# EAGLE schematic new_sawtag_2012 (EAGLE 6.5.0)

## Sheet 1 of 4
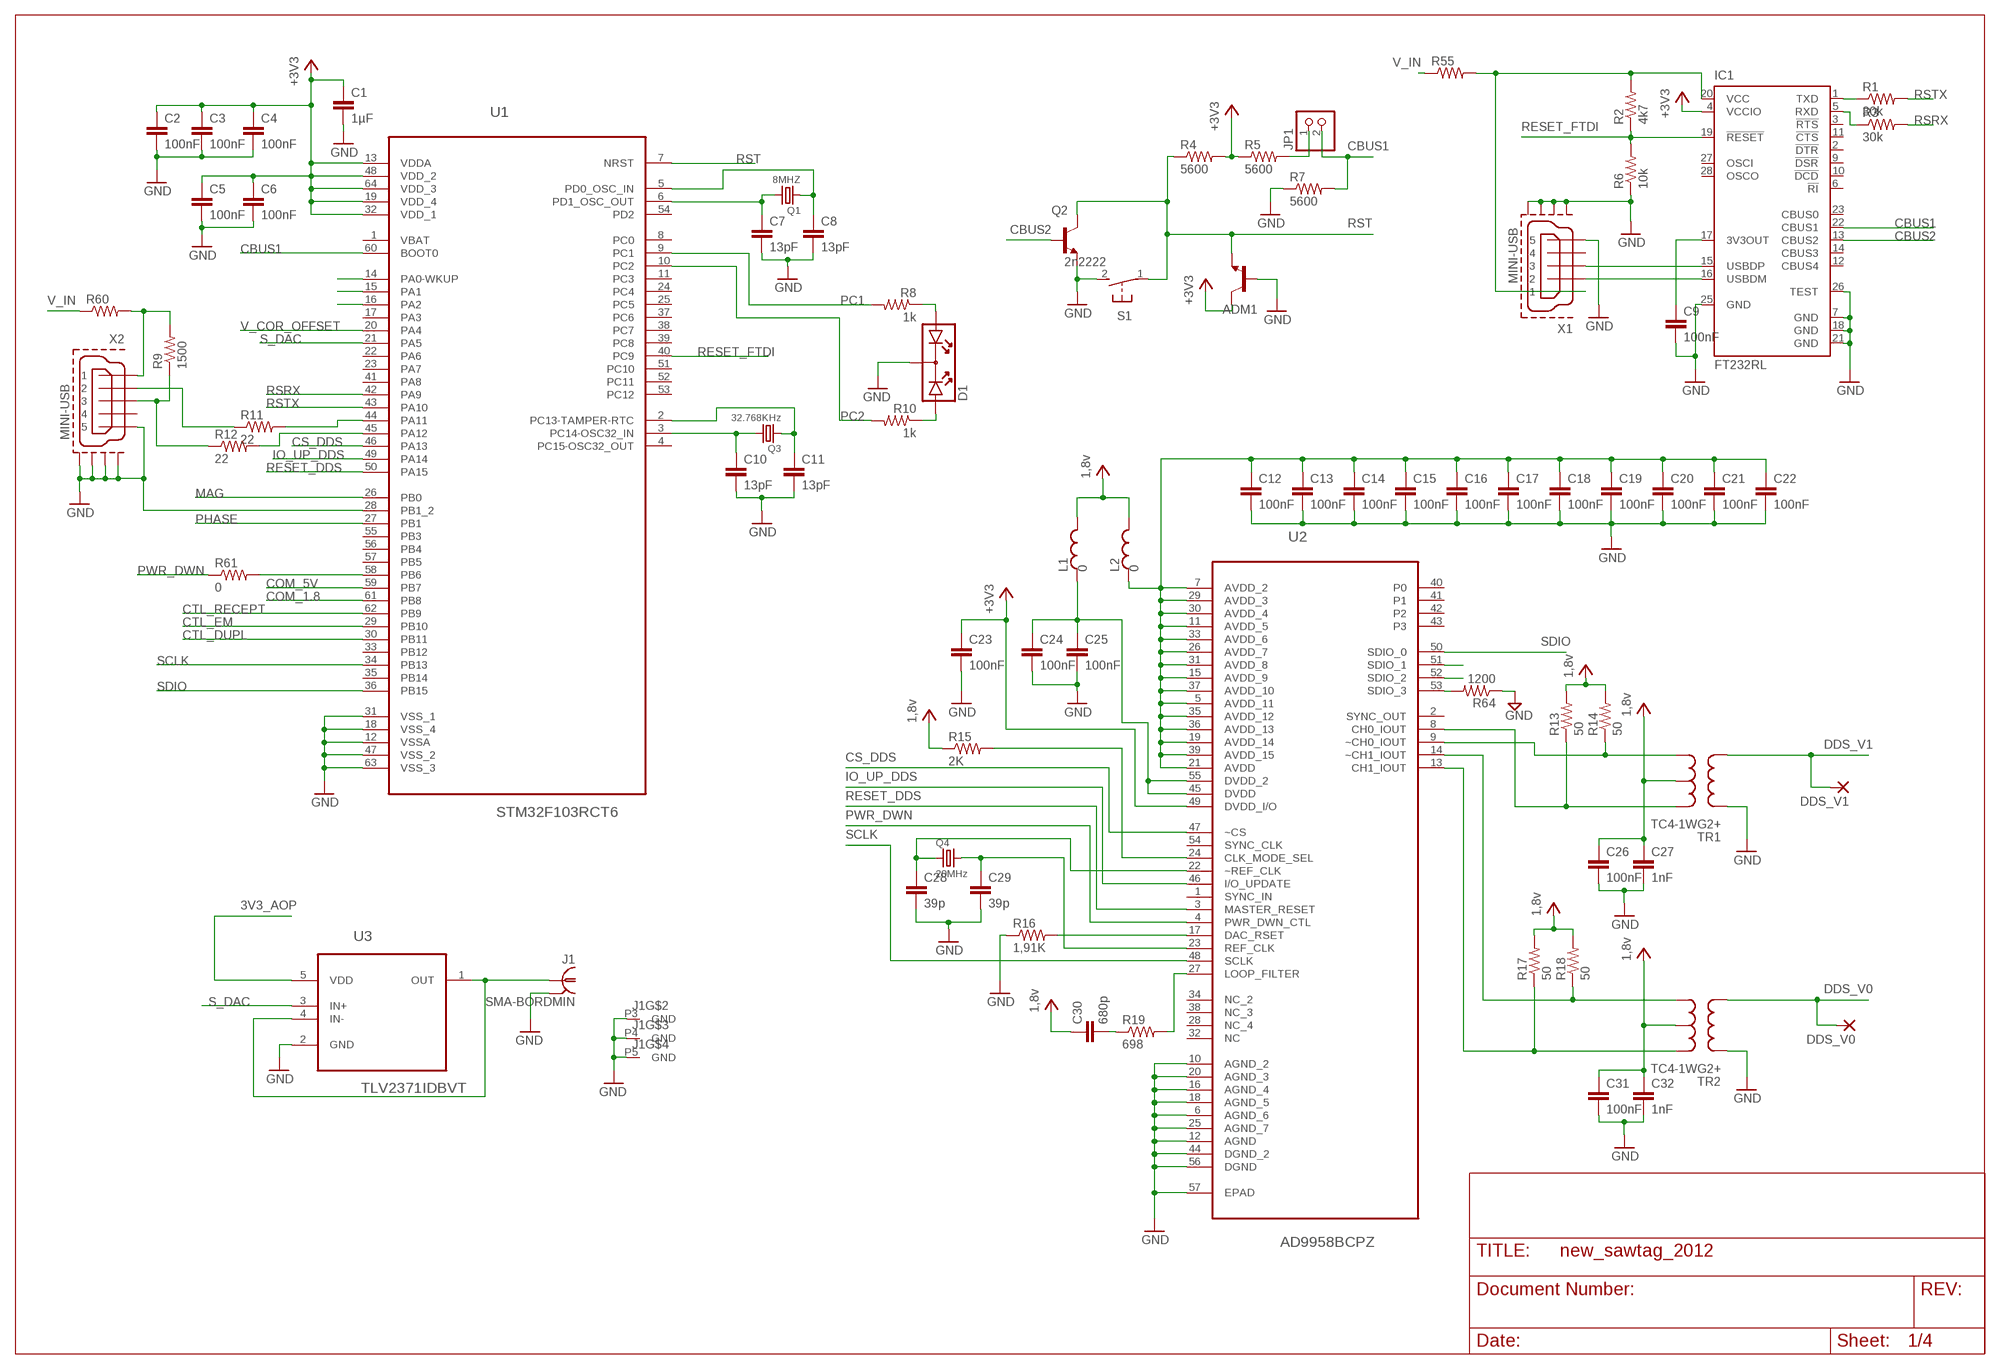
[diagram p0: schematic, sheet 1]

### Parts
ADM1  TRANSISTOR_NPNSOT23  [SOT23]
C1  1µF  C-EUC0805  [C0805]
C2  100nF  C-EUC0603  [C0603]
C3  100nF  C-EUC0603  [C0603]
C4  100nF  C-EUC0603  [C0603]
C5  100nF  C-EUC0603  [C0603]
C6  100nF  C-EUC0603  [C0603]
C7  13pF  C-EUC0603  [C0603]
C8  13pF  C-EUC0603  [C0603]
C9  100nF  C-EUC0603  [C0603]
C10  13pF  C-EUC0603  [C0603]
C11  13pF  C-EUC0603  [C0603]
C12  100nF  C-EUC0402  [C0402]
C13  100nF  C-EUC0402  [C0402]
C14  100nF  C-EUC0402  [C0402]
C15  100nF  C-EUC0402  [C0402]
C16  100nF  C-EUC0402  [C0402]
C17  100nF  C-EUC0402  [C0402]
C18  100nF  C-EUC0402  [C0402]
C19  100nF  C-EUC0402  [C0402]
C20  100nF  C-EUC0402  [C0402]
C21  100nF  C-EUC0402  [C0402]
C22  100nF  C-EUC0402  [C0402]
C23  100nF  C-EUC0603  [C0603]
C24  100nF  C-EUC0603  [C0603]
C25  100nF  C-EUC0603  [C0603]
C26  100nF  C-EUC0603  [C0603]
C27  1nF  C-EUC0402  [C0402]
C28  39p  C-EUC0402  [C0402]
C29  39p  C-EUC0402  [C0402]
C30  680p  C-EUC0402  [C0402]
C31  100nF  C-EUC0603  [C0603]
C32  1nF  C-EUC0402  [C0402]
D1  DUOLED  [DUOLED]
DDS_V0  1,6/0,8  [1,6/0,8]
DDS_V1  1,6/0,8  [1,6/0,8]
IC1  FT232RL  [SSOP28]
J1  SMA-BORDMIN  [SMA_BORDMIN]
JP1  PINHD-1X2  [1X02]
L1  0  L_0603  [0603]
L2  0  L_0603  [0603]
Q1  8MHZ  Q_20MHZ_SMD  [SMD_5*3]
Q2  2n2222  TRANSISTOR_NPNSOT23  [SOT23]
Q3  32.768KHz  Q_32K_SMD  [SMD_32K]
Q4  20MHz  Q_20MHZ_SMD  [SMD_5*3]
R1  30k  R-US_R0402  [R0402]
R2  4k7  R-US_R0402  [R0402]
R3  30k  R-US_R0402  [R0402]
R4  5600  R-US_R0603  [R0603]
R5  5600  R-US_R0603  [R0603]
R6  10k  R-US_R0402  [R0402]
R7  5600  R-US_R0603  [R0603]
R8  1k  R-US_R0603  [R0603]
R9  1500  R-US_R1206  [R1206]
R10  1k  R-US_R0603  [R0603]
R11  22  R-US_R0603  [R0603]
R12  22  R-US_R0603  [R0603]
R13  50  R-US_R0402  [R0402]
R14  50  R-US_R0402  [R0402]
R15  2K  R-US_R0402  [R0402]
R16  1,91K  R-US_R0402  [R0402]
R17  50  R-US_R0402  [R0402]
R18  50  R-US_R0402  [R0402]
R19  698  R-US_R0402  [R0402]
R55  R-US_R2512  [R2512]
R60  R-US_R2512  [R2512]
R61  0  R-US_R0603  [R0603]
R64  1200  R-US_R0402  [R0402]
S1  31-XX  [B3F-31XX]
TR1  TC4-1WG2+  [AT224-3]
TR2  TC4-1WG2+  [AT224-3]
U1  STM32F103RCT6  [QFP50P1200X1200X160-64N]
U2  AD9958BCPZ  [QFN50P800X800X100-57N]
U3  TLV2371IDBVT  [SOT95P280X145-5N]
X1  MINI-USB  MINI-USB-SHIELD-UX60-MB-5ST  [UX60-MB-5ST]
X2  MINI-USB  MINI-USB-SHIELD-UX60-MB-5ST  [UX60-MB-5ST]

### Nets
3V3_AOP: U3.5(VDD) ; also sheet 2,4
+3V3: ADM1.3(C) C1.1 C2.1 C3.1 C4.1 C5.1 C6.1 C23.1 IC1.4(VCCIO) R4.2 R5.1 U1.13(VDDA) U1.19(VDD_4) U1.32(VDD_1) U1.48(VDD_2) U1.64(VDD_3) U2.49(DVDD_I/O) ; also sheet 4
ALDDS: C12.1 C13.1 C14.1 C15.1 C16.1 C17.1 C18.1 C19.1 C20.1 C21.1 C22.1 L2.1 U2.5(AVDD_11) U2.7(AVDD_2) U2.11(AVDD_5) U2.15(AVDD_9) U2.19(AVDD_14) U2.21(AVDD) U2.26(AVDD_7) U2.29(AVDD_3) U2.30(AVDD_4) U2.31(AVDD_8) U2.33(AVDD_6) U2.35(AVDD_12) U2.36(AVDD_13) U2.37(AVDD_10) U2.39(AVDD_15)
CBUS1: IC1.22(CBUS1) JP1.2 R7.2 U1.60(BOOT0)
CBUS2: IC1.13(CBUS2) Q2.1(B)
COM_1.8: U1.61(PB8) ; also sheet 4
COM_5V: U1.59(PB7) ; also sheet 4
CS_DDS: U1.46(PA13) U2.47(~CS)
CTL_DUPL: U1.30(PB11) ; also sheet 3
CTL_EM: U1.29(PB10) ; also sheet 3
CTL_RECEPT: U1.62(PB9) ; also sheet 3
DDS_V0: DDS_V0.1(P) TR2.P6(P2) ; also sheet 3
DDS_V1: DDS_V1.1(P) TR1.P6(P2) ; also sheet 3
GND: ADM1.1(B) C1.2 C2.2 C3.2 C4.2 C5.2 C6.2 C7.2 C8.2 C9.2 C10.2 C11.2 C12.2 C13.2 C14.2 C15.2 C16.2 C17.2 C18.2 C19.2 C20.2 C21.2 C22.2 C23.2 C24.2 C25.2 C26.2 C27.2 C28.2 C29.2 C31.2 C32.2 D1.K IC1.7(GND) IC1.18(GND) IC1.21(GND) IC1.25(GND) IC1.26(TEST) J1.P1(GND) J1.P3(GND) J1.P4(GND) J1.P5(GND) Q2.2(E) R6.1 R7.1 R16.1 R64.1 S1.2(S) TR1.P4(P1) TR2.P4(P1) U1.12(VSSA) U1.18(VSS_4) U1.28(PB1_2) U1.31(VSS_1) U1.47(VSS_2) U1.63(VSS_3) U2.6(AGND_6) U2.10(AGND_2) U2.12(AGND) U2.16(AGND_4) U2.18(AGND_5) U2.20(AGND_3) U2.25(AGND_7) U2.44(DGND_2) U2.56(DGND) U2.57(EPAD) U3.2(GND) X1.5 X1.M1(GND1) X1.M2(GND2) X1.M3(GND3) X1.M4(GND4) X2.5 X2.M1(GND1) X2.M2(GND2) X2.M3(GND3) X2.M4(GND4) ; also sheet 2,3,4
IO_UP_DDS: U1.49(PA14) U2.46(I/O_UPDATE)
MAG: U1.26(PB0) ; also sheet 2
N$1: R16.2 U2.17(DAC_RSET)
N$2: R19.2 U2.27(LOOP_FILTER)
N$3: C30.2 R19.1
N$4: C28.1 Q4.P$1 U2.22(~REF_CLK)
N$5: C29.1 Q4.P$3 U2.23(REF_CLK)
N$6: R15.2 U2.24(CLK_MODE_SEL)
N$7: R17.1 TR2.P3(S1) U2.13(CH1_IOUT)
N$8: R18.1 TR2.P1(S3) U2.14(~CH1_IOUT)
N$9: R14.1 TR1.P1(S3) U2.9(~CH0_IOUT)
N$83: R13.1 TR1.P3(S1) U2.8(CH0_IOUT)
N$96: C24.1 C25.1 L1.1 U2.45(DVDD) U2.55(DVDD_2)
N$97: R9.2 R60.2 X2.1
N$98: J1.P2 U3.1(OUT) U3.4(IN-)
N$105: R61.2 U1.58(PB6)
N$106: R11.2 U1.44(PA11)
N$107: IC1.16(USBDM) X1.2
N$112: IC1.20(VCC) R2.2 R55.2 X1.1
N$119: R12.2 U1.45(PA12)
N$120: IC1.15(USBDP) X1.3
N$122: C9.1 IC1.17(3V3OUT)
N$123: IC1.1(TXD) R1.1
N$124: IC1.5(RXD) R3.1
N$127: C8.1 Q1.P$1 U1.5(PD0_OSC_IN)
N$128: JP1.1 R5.2
N$129: C7.1 Q1.P$3 U1.6(PD1_OSC_OUT)
N$135: R11.1 X2.2
N$139: D1.A2 R8.1
N$140: C10.1 Q3.P$2 U1.3(PC14-OSC32_IN)
N$141: C11.1 Q3.P$1 U1.2(PC13-TAMPER-RTC)
N$142: D1.A1 R10.1
N$143: R9.1 R12.1 X2.3
PC1: R8.2 U1.9(PC1)
PC2: R10.2 U1.10(PC2)
PHASE: U1.27(PB1) ; also sheet 2
PWR_DWN: R61.1 U2.4(PWR_DWN_CTL)
RESET_DDS: U1.50(PA15) U2.3(MASTER_RESET)
RESET_FTDI: IC1.19(!RESET) R2.1 R6.2 U1.40(PC9)
RSRX: R3.2 U1.42(PA9)
RST: ADM1.2(E) Q2.3(C) R4.1 S1.1(P) U1.7(NRST)
RSTX: R1.2 U1.43(PA10)
S_DAC: U1.21(PA5) U3.3(IN+)
SCLK: U1.34(PB13) U2.48(SCLK)
SDIO: U1.36(PB15) U2.50(SDIO_0)
SDIO_1: U1.14(PA0-WKUP) U2.51(SDIO_1)
SDIO_2: U1.15(PA1) U2.52(SDIO_2)
SDIO_3: R64.2 U1.16(PA2) U2.53(SDIO_3)
V_COR_OFFSET: U1.20(PA4) ; also sheet 2
V_IN: R55.1 R60.1 ; also sheet 4
VCC: C26.1 C27.1 C30.1 C31.1 C32.1 L1.2 L2.2 R13.2 R14.2 R15.1 R17.2 R18.2 TR1.P2(S2) TR2.P2(S2) ; supply symbol labelled 1,8v ; also sheet 4
Unconnected: IC1.2(!DTR) IC1.3(!RTS) IC1.6(!RI) IC1.9(!DSR) IC1.10(!DCD) IC1.11(!CTS) IC1.12(CBUS4) IC1.14(CBUS3) IC1.23(CBUS0) IC1.27(OSCI) IC1.28(OSCO) U1.1(VBAT) U1.4(PC15-OSC32_OUT) U1.8(PC0) U1.11(PC3) U1.17(PA3) U1.22(PA6) U1.24(PC4) U1.25(PC5) U1.33(PB12) U1.35(PB14) U1.37(PC6) U1.38(PC7) U1.39(PC8) U1.41(PA8) U1.51(PC10) U1.52(PC11) U1.53(PC12) U1.54(PD2) U1.55(PB3) U1.56(PB4) U1.57(PB5) U2.1(SYNC_IN) U2.2(SYNC_OUT) U2.28(NC_4) U2.32(NC) U2.34(NC_2) U2.38(NC_3) U2.40(P0) U2.41(P1) U2.42(P2) U2.43(P3) U2.54(SYNC_CLK) X1.4 X2.4

## Sheet 2 of 4
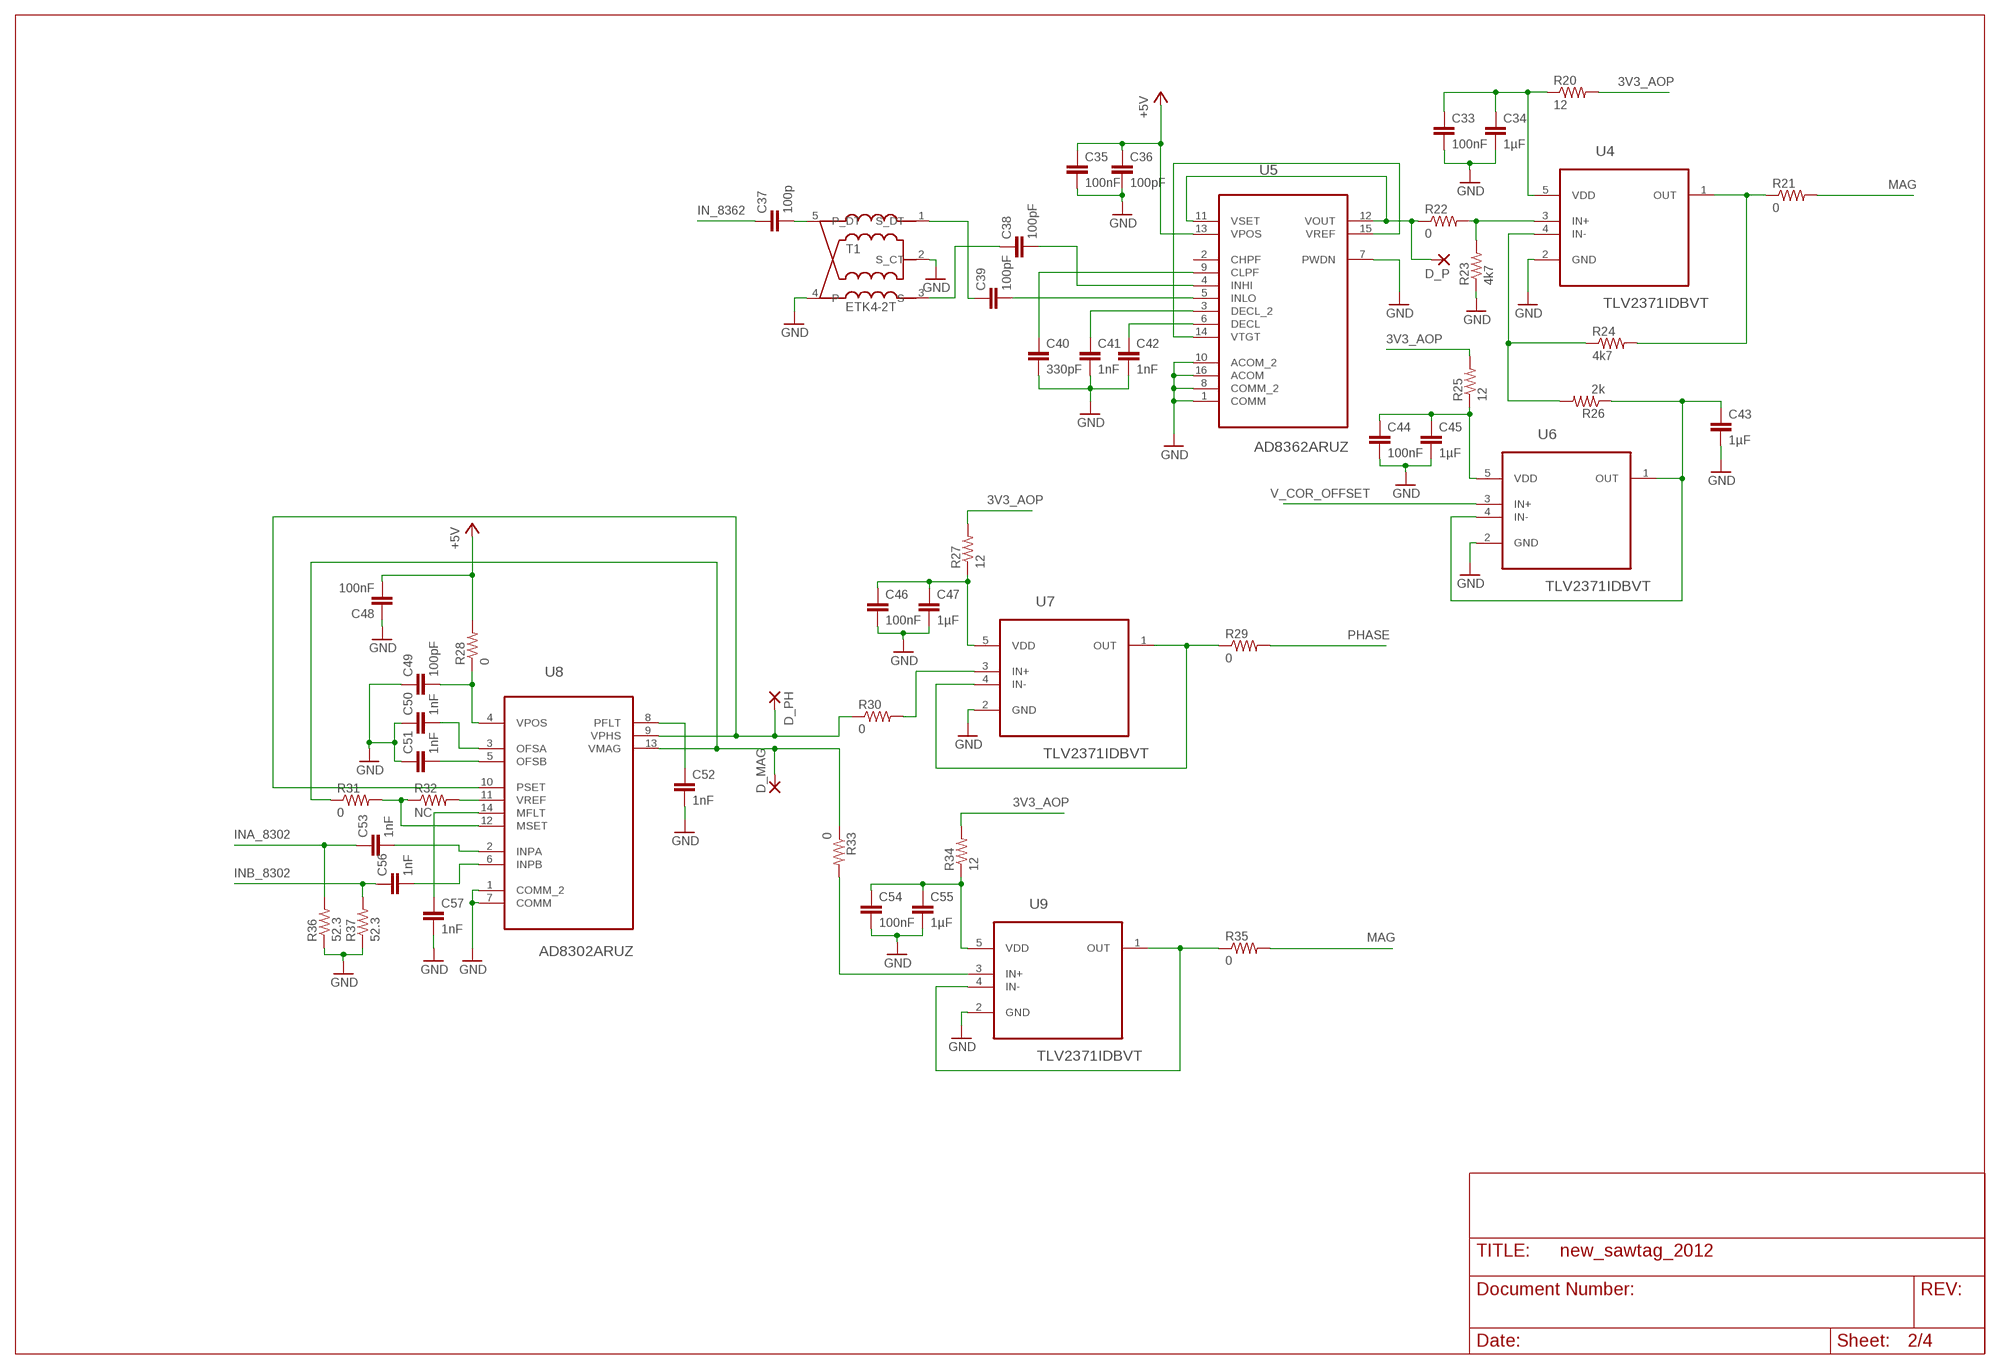
[diagram p1: schematic, sheet 2]

### Parts
C33  100nF  C-EUC0402  [C0402]
C34  1µF  C-EUC0603  [C0603]
C35  100nF  C-EUC0603  [C0603]
C36  100pF  C-EUC0603  [C0603]
C37  100p  C-EUC0402  [C0402]
C38  100pF  C-EUC0402  [C0402]
C39  100pF  C-EUC0402  [C0402]
C40  330pF  C-EUC0603  [C0603]
C41  1nF  C-EUC0603  [C0603]
C42  1nF  C-EUC0603  [C0603]
C43  1µF  C-EUC0603  [C0603]
C44  100nF  C-EUC0402  [C0402]
C45  1µF  C-EUC0603  [C0603]
C46  100nF  C-EUC0402  [C0402]
C47  1µF  C-EUC0603  [C0603]
C48  100nF  C-EUC0603  [C0603]
C49  100pF  C-EUC0402  [C0402]
C50  1nF  C-EUC0402  [C0402]
C51  1nF  C-EUC0402  [C0402]
C52  1nF  C-EUC0402  [C0402]
C53  1nF  C-EUC0402  [C0402]
C54  100nF  C-EUC0402  [C0402]
C55  1µF  C-EUC0603  [C0603]
C56  1nF  C-EUC0402  [C0402]
C57  1nF  C-EUC0402  [C0402]
D_MAG  1,6/0,8  [1,6/0,8]
D_P  1,6/0,8  [1,6/0,8]
D_PH  1,6/0,8  [1,6/0,8]
R20  12  R-US_R0603  [R0603]
R21  0  R-US_R0603  [R0603]
R22  0  R-US_R0603  [R0603]
R23  4k7  R-US_R0603  [R0603]
R24  4k7  R-US_R0603  [R0603]
R25  12  R-US_R0603  [R0603]
R26  2k  R-US_R0603  [R0603]
R27  12  R-US_R0603  [R0603]
R28  0  R-US_R0603  [R0603]
R29  0  R-US_R0603  [R0603]
R30  0  R-US_R0603  [R0603]
R31  0  R-US_R0603  [R0603]
R32  NC  R-US_R0603  [R0603]
R33  0  R-US_R0603  [R0603]
R34  12  R-US_R0603  [R0603]
R35  0  R-US_R0603  [R0603]
R36  52.3  R-US_R0603  [R0603]
R37  52.3  R-US_R0603  [R0603]
T1  ETK4-2T  [SM-22]
U4  TLV2371IDBVT  [SOT95P280X145-5N]
U5  AD8362ARUZ  [SOP65P640X120-16N]
U6  TLV2371IDBVT  [SOT95P280X145-5N]
U7  TLV2371IDBVT  [SOT95P280X145-5N]
U8  AD8302ARUZ  [SOP65P640X120-14N]
U9  TLV2371IDBVT  [SOT95P280X145-5N]

### Nets
3V3_AOP: R20.2 R25.2 R27.2 R34.2 ; also sheet 1,4
+5V: C35.1 C36.1 C48.2 R28.2 U5.13(VPOS) ; also sheet 3,4
GND: C33.2 C34.2 C35.2 C36.2 C40.2 C41.2 C42.2 C43.2 C44.2 C45.2 C46.2 C47.2 C48.1 C49.1 C50.1 C51.1 C52.2 C54.2 C55.2 C57.2 R23.1 R36.1 R37.1 T1.2(S_CT) T1.4(P) U4.2(GND) U5.1(COMM) U5.7(PWDN) U5.8(COMM_2) U5.10(ACOM_2) U5.16(ACOM) U6.2(GND) U7.2(GND) U8.1(COMM_2) U8.7(COMM) U9.2(GND) ; also sheet 1,3,4
IN_8362: C37.1 ; also sheet 3
INA_8302: C53.1 R36.2 ; also sheet 3
INB_8302: C56.1 R37.2 ; also sheet 3
MAG: R21.2 R35.2 ; also sheet 1
N$10: D_P.1(P) R22.1 U5.11(VSET) U5.12(VOUT)
N$11: R22.2 R23.2 U4.3(IN+)
N$13: C42.1 U5.6(DECL)
N$14: C41.1 U5.3(DECL_2)
N$15: C40.1 U5.9(CLPF)
N$16: C39.2 U5.5(INLO)
N$17: C38.2 U5.4(INHI)
N$18: R24.1 R26.2 U4.4(IN-)
N$19: U5.14(VTGT) U5.15(VREF)
N$20: C43.1 R26.1 U6.1(OUT) U6.4(IN-)
N$21: C33.1 C34.1 R20.1 U4.5(VDD)
N$22: C50.2 U8.3(OFSA)
N$23: C51.2 U8.5(OFSB)
N$24: C53.2 U8.2(INPA)
N$25: C56.2 U8.6(INPB)
N$26: C44.1 C45.1 R25.1 U6.5(VDD)
N$29: C49.2 R28.1 U8.4(VPOS)
N$31: R30.2 U7.3(IN+)
N$32: R29.1 U7.1(OUT) U7.4(IN-)
N$33: R33.2 U9.3(IN+)
N$34: R35.1 U9.1(OUT) U9.4(IN-)
N$35: C46.1 C47.1 R27.1 U7.5(VDD)
N$36: C54.1 C55.1 R34.1 U9.5(VDD)
N$37: D_MAG.1(P) R31.1 R33.1 U8.13(VMAG)
N$38: D_PH.1(P) R30.1 U8.9(VPHS) U8.10(PSET)
N$81: C39.1 T1.1(S_DT)
N$82: C38.1 T1.3(S)
N$84: C57.1 U8.14(MFLT)
N$85: C52.1 U8.8(PFLT)
N$87: C37.2 T1.5(P_DT)
N$95: R21.1 R24.2 U4.1(OUT)
N$100: R31.2 R32.1 U8.12(MSET)
N$102: R32.2 U8.11(VREF)
PHASE: R29.2 ; also sheet 1
V_COR_OFFSET: U6.3(IN+) ; also sheet 1
Unconnected: U5.2(CHPF)

## Sheet 3 of 4
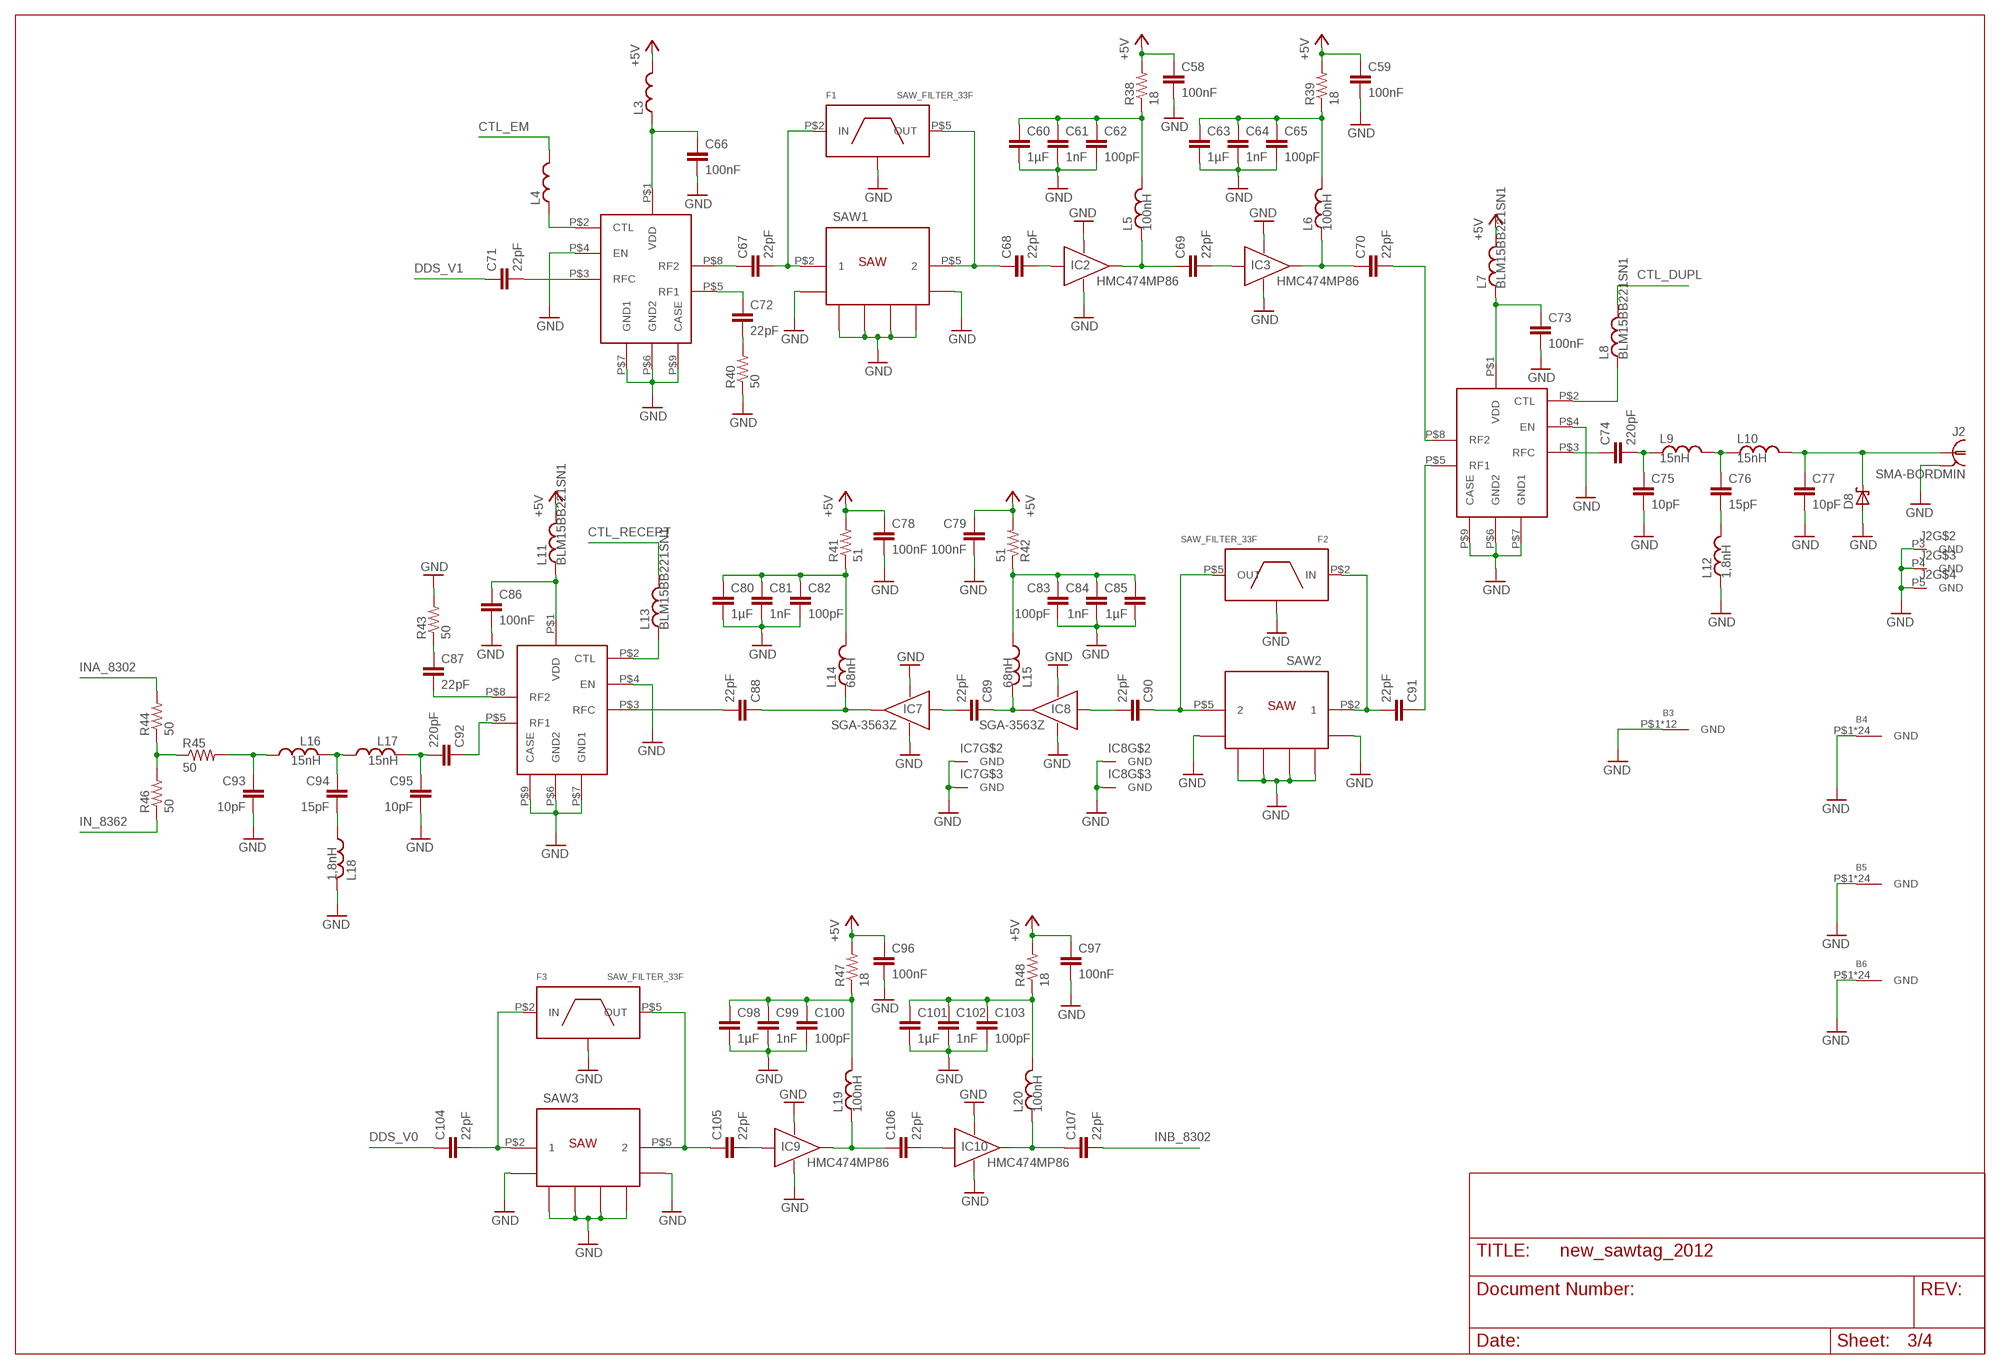
[diagram p2: schematic, sheet 3]

### Parts
B3  BMIS-102  [BMIS-102]
B4  BMIS-205  [BMIS-205]
B5  BMIS-205  [BMIS-205]
B6  BMIS-205  [BMIS-205]
C58  100nF  C-EUC0603  [C0603]
C59  100nF  C-EUC0603  [C0603]
C60  1µF  C-EUC0603  [C0603]
C61  1nF  C-EUC0402  [C0402]
C62  100pF  C-EUC0402  [C0402]
C63  1µF  C-EUC0603  [C0603]
C64  1nF  C-EUC0402  [C0402]
C65  100pF  C-EUC0402  [C0402]
C66  100nF  C-EUC0603  [C0603]
C67  22pF  C-EUC0402  [C0402]
C68  22pF  C-EUC0402  [C0402]
C69  22pF  C-EUC0402  [C0402]
C70  22pF  C-EUC0402  [C0402]
C71  22pF  C-EUC0402  [C0402]
C72  22pF  C-EUC0402  [C0402]
C73  100nF  C-EUC0402  [C0402]
C74  220pF  C-EUC0402  [C0402]
C75  10pF  C-EUC0402  [C0402]
C76  15pF  C-EUC0402  [C0402]
C77  10pF  C-EUC0402  [C0402]
C78  100nF  C-EUC0603  [C0603]
C79  100nF  C-EUC0603  [C0603]
C80  1µF  C-EUC0603  [C0603]
C81  1nF  C-EUC0402  [C0402]
C82  100pF  C-EUC0402  [C0402]
C83  100pF  C-EUC0402  [C0402]
C84  1nF  C-EUC0402  [C0402]
C85  1µF  C-EUC0603  [C0603]
C86  100nF  C-EUC0603  [C0603]
C87  22pF  C-EUC0402  [C0402]
C88  22pF  C-EUC0402  [C0402]
C89  22pF  C-EUC0402  [C0402]
C90  22pF  C-EUC0402  [C0402]
C91  22pF  C-EUC0402  [C0402]
C92  220pF  C-EUC0402  [C0402]
C93  10pF  C-EUC0402  [C0402]
C94  15pF  C-EUC0402  [C0402]
C95  10pF  C-EUC0402  [C0402]
C96  100nF  C-EUC0603  [C0603]
C97  100nF  C-EUC0603  [C0603]
C98  1µF  C-EUC0603  [C0603]
C99  1nF  C-EUC0402  [C0402]
C100  100pF  C-EUC0402  [C0402]
C101  1µF  C-EUC0603  [C0603]
C102  1nF  C-EUC0402  [C0402]
C103  100pF  C-EUC0402  [C0402]
C104  22pF  C-EUC0402  [C0402]
C105  22pF  C-EUC0402  [C0402]
C106  22pF  C-EUC0402  [C0402]
C107  22pF  C-EUC0402  [C0402]
D8  SMF5.0AT1  [SOD123FL]
F1  SAW_FILTER_33F  [BOITIER_3-3]
F2  SAW_FILTER_33F  [BOITIER_3-3]
F3  SAW_FILTER_33F  [BOITIER_3-3]
IC2  HMC474MP86  [VV105]
IC3  HMC474MP86  [VV105]
IC4  HMC349MS8G  [SMT-MS8G]
IC5  HMC349MS8G  [SMT-MS8G]
IC6  HMC349MS8G  [SMT-MS8G]
IC7  SGA-3563Z  [SOT363]
IC8  SGA-3563Z  [SOT363]
IC9  HMC474MP86  [VV105]
IC10  HMC474MP86  [VV105]
J2  SMA-BORDMIN  [SMA_BORDMIN]
L3  L_0402  [0402]
L4  L_0402  [0402]
L5  100nH  L_0603  [0603]
L6  100nH  L_0603  [0603]
L7  BLM15BB221SN1  L_0402  [0402]
L8  BLM15BB221SN1  L_0402  [0402]
L9  15nH  L_0603  [0603]
L10  15nH  L_0603  [0603]
L11  BLM15BB221SN1  L_0402  [0402]
L12  1,8nH  L_0603  [0603]
L13  BLM15BB221SN1  L_0402  [0402]
L14  68nH  L_0603  [0603]
L15  68nH  L_0603  [0603]
L16  15nH  L_0603  [0603]
L17  15nH  L_0603  [0603]
L18  1,8nH  L_0603  [0603]
L19  100nH  L_0603  [0603]
L20  100nH  L_0603  [0603]
R38  18  R-US_R0603  [R0603]
R39  18  R-US_R0603  [R0603]
R40  50  R-US_R0603  [R0603]
R41  51  R-US_R0603  [R0603]
R42  51  R-US_R0603  [R0603]
R43  50  R-US_R0402  [R0402]
R44  50  R-US_R0402  [R0402]
R45  50  R-US_R0402  [R0402]
R46  50  R-US_R0402  [R0402]
R47  18  R-US_R0603  [R0603]
R48  18  R-US_R0603  [R0603]
SAW1  SAW_DBLPORT  [BOITIER_5-5]
SAW2  SAW_DBLPORT  [BOITIER_5-5]
SAW3  SAW_DBLPORT  [BOITIER_5-5]

### Nets
+5V: C58.1 C59.1 C78.1 C79.1 C96.1 C97.1 L3.2 L7.2 L11.2 R38.2 R39.2 R41.2 R42.2 R47.2 R48.2 ; also sheet 2,4
CTL_DUPL: L8.2 ; also sheet 1
CTL_EM: L4.2 ; also sheet 1
CTL_RECEPT: L13.2 ; also sheet 1
DDS_V0: C104.1 ; also sheet 1
DDS_V1: C71.1 ; also sheet 1
GND: B3.P$1(GND) B3.P$2(GND) B3.P$3(GND) B3.P$4(GND) B3.P$5(GND) B3.P$6(GND) B3.P$7(GND) B3.P$8(GND) B3.P$9(GND) B3.P$10(GND) B3.P$11(GND) B3.P$12(GND) B4.P$1(GND) B4.P$2(GND) B4.P$3(GND) B4.P$4(GND) B4.P$5(GND) B4.P$6(GND) B4.P$7(GND) B4.P$8(GND) B4.P$9(GND) B4.P$10(GND) B4.P$11(GND) B4.P$12(GND) B4.P$13(GND) B4.P$14(GND) B4.P$15(GND) B4.P$16(GND) B4.P$17(GND) B4.P$18(GND) B4.P$19(GND) B4.P$20(GND) B4.P$21(GND) B4.P$22(GND) B4.P$23(GND) B4.P$24(GND) B5.P$1(GND) B5.P$2(GND) B5.P$3(GND) B5.P$4(GND) B5.P$5(GND) B5.P$6(GND) B5.P$7(GND) B5.P$8(GND) B5.P$9(GND) B5.P$10(GND) B5.P$11(GND) B5.P$12(GND) B5.P$13(GND) B5.P$14(GND) B5.P$15(GND) B5.P$16(GND) B5.P$17(GND) B5.P$18(GND) B5.P$19(GND) B5.P$20(GND) B5.P$21(GND) B5.P$22(GND) B5.P$23(GND) B5.P$24(GND) B6.P$1(GND) B6.P$2(GND) B6.P$3(GND) B6.P$4(GND) B6.P$5(GND) B6.P$6(GND) B6.P$7(GND) B6.P$8(GND) B6.P$9(GND) B6.P$10(GND) B6.P$11(GND) B6.P$12(GND) B6.P$13(GND) B6.P$14(GND) B6.P$15(GND) B6.P$16(GND) B6.P$17(GND) B6.P$18(GND) B6.P$19(GND) B6.P$20(GND) B6.P$21(GND) B6.P$22(GND) B6.P$23(GND) B6.P$24(GND) C58.2 C59.2 C60.2 C61.2 C62.2 C63.2 C64.2 C65.2 C66.2 C73.2 C75.2 C77.2 C78.2 C79.2 C80.2 C81.2 C82.2 C83.2 C84.2 C85.2 C86.2 C93.2 C95.2 C96.2 C97.2 C98.2 C99.2 C100.2 C101.2 C102.2 C103.2 D8.A F1.P$1 F2.P$1 F3.P$1 IC2.2(V_1) IC2.4(V_2) IC3.2(V_1) IC3.4(V_2) IC4.P$4(EN) IC4.P$6(GND2) IC4.P$7(GND1) IC4.P$9(CASE) IC5.P$4(EN) IC5.P$6(GND2) IC5.P$7(GND1) IC5.P$9(CASE) IC6.P$4(EN) IC6.P$6(GND2) IC6.P$7(GND1) IC6.P$9(CASE) IC7.P$1(V_1) IC7.P$2(GND) IC7.P$4(V_2) IC7.P$5(GND) IC8.P$1(V_1) IC8.P$2(GND) IC8.P$4(V_2) IC8.P$5(GND) IC9.2(V_1) IC9.4(V_2) IC10.2(V_1) IC10.4(V_2) J2.P1(GND) J2.P3(GND) J2.P4(GND) J2.P5(GND) L12.1 L18.1 R40.1 R43.2 SAW1.P$1(GND1) SAW1.P$3(GND2) SAW1.P$4(GND3) SAW1.P$6(GND4) SAW1.P$7(GND5) SAW1.P$8(GND6) SAW2.P$1(GND1) SAW2.P$3(GND2) SAW2.P$4(GND3) SAW2.P$6(GND4) SAW2.P$7(GND5) SAW2.P$8(GND6) SAW3.P$1(GND1) SAW3.P$3(GND2) SAW3.P$4(GND3) SAW3.P$6(GND4) SAW3.P$7(GND5) SAW3.P$8(GND6) ; also sheet 1,2,4
IN_8362: R46.1 ; also sheet 2
INA_8302: R44.2 ; also sheet 2
INB_8302: C107.2 ; also sheet 2
N$39: C67.2 F1.P$2(IN) SAW1.P$2
N$40: C67.1 IC4.P$8(RF2)
N$41: C70.1 IC3.3(OUT) L6.1
N$42: C68.1 F1.P$5(OUT) SAW1.P$5
N$43: C68.2 IC2.1(IN)
N$44: C63.1 C64.1 C65.1 L6.2 R39.1
N$45: C72.1 IC4.P$5(RF1)
N$46: C60.1 C61.1 C62.1 L5.2 R38.1
N$47: C69.1 IC2.3(OUT) L5.1
N$48: C69.2 IC3.1(IN)
N$49: C72.2 R40.2
N$50: C91.2 F2.P$2(IN) SAW2.P$2
N$51: C91.1 IC5.P$5(RF1)
N$52: C90.1 F2.P$5(OUT) SAW2.P$5
N$53: C90.2 IC8.P$3(IN)
N$54: C89.1 IC8.P$6(OUT) L15.1
N$55: C83.1 C84.1 C85.1 L15.2 R42.1
N$56: C88.1 IC7.P$6(OUT) L14.1
N$57: C80.1 C81.1 C82.1 L14.2 R41.1
N$58: C89.2 IC7.P$3(IN)
N$59: C70.2 IC5.P$8(RF2)
N$60: C92.1 IC6.P$5(RF1)
N$61: C87.2 IC6.P$8(RF2)
N$62: C74.1 IC5.P$3(RFC)
N$63: C74.2 C75.1 L9.1
N$64: C76.1 L9.2 L10.1
N$65: C76.2 L12.2
N$66: C77.1 D8.C J2.P2 L10.2
N$67: C88.2 IC6.P$3(RFC)
N$68: C87.1 R43.1
N$69: C73.1 IC5.P$1(VDD) L7.1
N$70: C92.2 C95.1 L17.1
N$71: C94.1 L16.1 L17.2
N$72: C94.2 L18.2
N$73: C93.1 L16.2 R45.2
N$74: IC5.P$2(CTL) L8.1
N$75: C66.1 IC4.P$1(VDD) L3.1
N$76: C71.2 IC4.P$3(RFC)
N$77: C86.1 IC6.P$1(VDD) L11.1
N$78: IC4.P$2(CTL) L4.1
N$79: IC6.P$2(CTL) L13.1
N$80: R44.1 R45.1 R46.2
N$86: C104.2 F3.P$2(IN) SAW3.P$2
N$88: C105.1 F3.P$5(OUT) SAW3.P$5
N$89: C105.2 IC9.1(IN)
N$90: C98.1 C99.1 C100.1 L19.2 R47.1
N$91: C106.1 IC9.3(OUT) L19.1
N$92: C106.2 IC10.1(IN)
N$93: C107.1 IC10.3(OUT) L20.1
N$94: C101.1 C102.1 C103.1 L20.2 R48.1

## Sheet 4 of 4
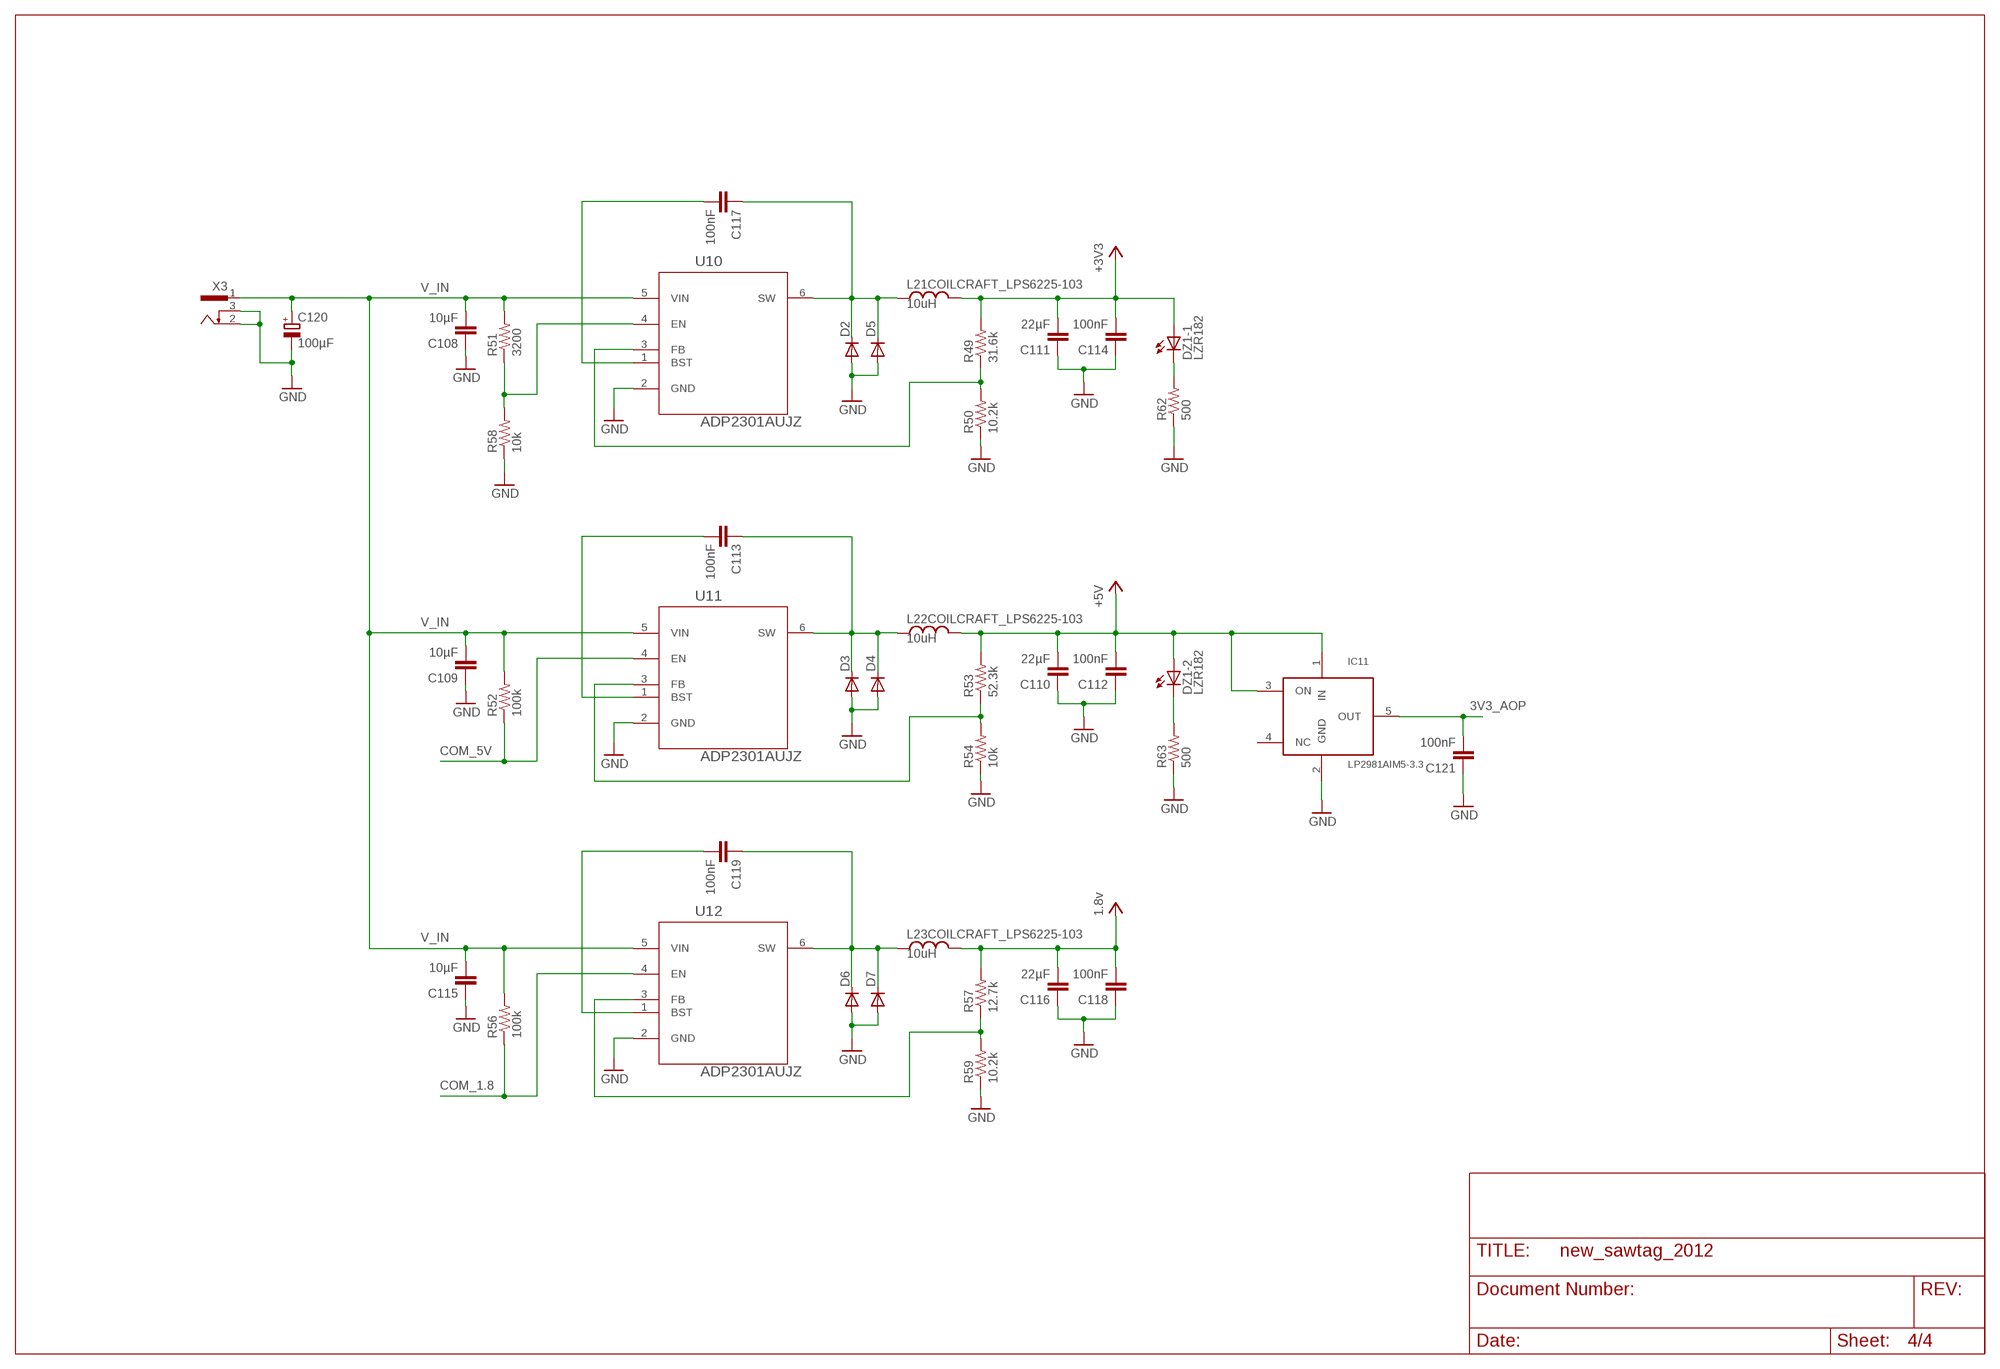
[diagram p3: schematic, sheet 4]

### Parts
C108  10µF  C-EUC0805  [C0805]
C109  10µF  C-EUC0805  [C0805]
C110  22µF  C-EUC0805  [C0805]
C111  22µF  C-EUC0805  [C0805]
C112  100nF  C-EUC0805  [C0805]
C113  100nF  C-EUC0805  [C0805]
C114  100nF  C-EUC0805  [C0805]
C115  10µF  C-EUC0805  [C0805]
C116  22µF  C-EUC0805  [C0805]
C117  100nF  C-EUC0805  [C0805]
C118  100nF  C-EUC0805  [C0805]
C119  100nF  C-EUC0603  [C0603]
C120  100µF  CPOL-EU140CLH-1010  [140CLH-1010]
C121  100nF  C-EUC0805  [C0805]
D2  DIODE-SMB  [SMB]
D3  DIODE-SMB  [SMB]
D4  DIODE-SMC  [SMC]
D5  DIODE-SMC  [SMC]
D6  DIODE-SMB  [SMB]
D7  DIODE-SMC  [SMC]
DZ1  LZR182  [LZR182]
IC11  LP2981AIM5-3.3  [SOT23-M5]
L21COILCRAFT_LPS6225-103  10uH  LPS6225  [L_DCDC_6*6]
L22COILCRAFT_LPS6225-103  10uH  LPS6225  [L_DCDC_6*6]
L23COILCRAFT_LPS6225-103  10uH  LPS6225  [L_DCDC_6*6]
R49  31.6k  R-US_R0603  [R0603]
R50  10.2k  R-US_R0603  [R0603]
R51  3200  R-US_R0603  [R0603]
R52  100k  R-US_R0603  [R0603]
R53  52.3k  R-US_R0603  [R0603]
R54  10k  R-US_R0603  [R0603]
R56  100k  R-US_R0603  [R0603]
R57  12.7k  R-US_R0603  [R0603]
R58  10k  R-US_R0603  [R0603]
R59  10.2k  R-US_R0603  [R0603]
R62  500  R-US_R0402  [R0402]
R63  500  R-US_R0402  [R0402]
U10  ADP2301AUJZ  [SOT95P280X90-6N]
U11  ADP2301AUJZ  [SOT95P280X90-6N]
U12  ADP2301AUJZ  [SOT95P280X90-6N]
X3  733980-62  [733980-62]

### Nets
3V3_AOP: C121.2 IC11.5(OUT) ; also sheet 1,2
+3V3: C111.2 C114.2 DZ1.A1(-1:A) L21COILCRAFT_LPS6225-103.P$2 R49.2 ; also sheet 1
+5V: C110.2 C112.2 DZ1.A2(-2:A) IC11.1(IN) IC11.3(ON) L22COILCRAFT_LPS6225-103.P$2 R53.2 ; also sheet 2,3
COM_1.8: R56.1 U12.4(EN) ; also sheet 1
COM_5V: R52.1 U11.4(EN) ; also sheet 1
GND: C108.1 C109.1 C110.1 C111.1 C112.1 C114.1 C115.1 C116.1 C118.1 C120.- C121.1 D2.A D3.A D4.A D5.A D6.A D7.A IC11.2(GND) R50.1 R54.1 R58.1 R59.1 R62.1 R63.1 U10.2(GND) U11.2(GND) U12.2(GND) X3.2 X3.3 ; also sheet 1,2,3
N$12: C113.1 D3.C D4.C L22COILCRAFT_LPS6225-103.P$1 U11.6(SW)
N$27: C117.1 D2.C D5.C L21COILCRAFT_LPS6225-103.P$1 U10.6(SW)
N$28: R49.1 R50.2 U10.3(FB)
N$30: R53.1 R54.2 U11.3(FB)
N$99: C117.2 U10.1(BST)
N$101: DZ1.K1(-1:C) R62.2
N$103: R51.1 R58.2 U10.4(EN)
N$104: C113.2 U11.1(BST)
N$108: C119.1 D6.C D7.C L23COILCRAFT_LPS6225-103.P$1 U12.6(SW)
N$109: R57.1 R59.2 U12.3(FB)
N$110: C119.2 U12.1(BST)
N$111: DZ1.K2(-2:C) R63.2
V_IN: C108.2 C109.2 C115.2 C120.+ R51.2 R52.2 R56.2 U10.5(VIN) U11.5(VIN) U12.5(VIN) X3.1 ; also sheet 1
VCC: C116.2 C118.2 L23COILCRAFT_LPS6225-103.P$2 R57.2 ; supply symbol labelled 1.8v ; also sheet 1
Unconnected: IC11.4(NC)

## Power pins joined to a net without a drawn wire
GND: F1.P$3(GND) F1.P$4(GND) F1.P$6(GND) F2.P$3(GND) F2.P$4(GND) F2.P$6(GND) F3.P$3(GND) F3.P$4(GND) F3.P$6(GND)
PA7: U1.23(PA7)

## Library data of the parts
ADM1 Q2 = SparkFun-3-2-07:TRANSISTOR_NPN: Transistor NPN BJT configuration in SOT23 package. MMBT2222 is the common NPN we use. Double check BCE configuration again layout.
B3 = g_blindage:BMIS-102
B4-B6 = g_blindage:BMIS-205
C1-C119 C121 = rcl:C-EU: CAPACITOR, European symbol
C120 = rcl:CPOL-EU: POLARIZED CAPACITOR, European symbol
D1 = special:DUOLED: Duo LED
D2-D7 = diode:DIODE-: DIODE
D8 = diode:SMF5.0AT1: 200 W Transient Voltage Suppressor Source: Data sheet <http://www.onsemi.com/pub_link/Collateral/SMF5.0AT1-D.PDF>
D_MAG D_P D_PH DDS_V0 DDS_V1 = wirepad:1,6/0,8: THROUGH-HOLE PAD
DZ1 = led:LZR182: LED BLOCK 2 LEDs, Siemens
F1-F3 = gilloux_rf:SAW_FILTER_3*3
IC1 = ftdichip:FT232R: Source: http://www.ftdichip.com/Documents/DataSheets/DS_FT232R_v104.pdf
IC2 IC3 IC9 IC10 = gilloux_rf:HMC474MP86
IC4-IC6 = gilloux_rf:HMC349MS8G
IC7 IC8 = gilloux_rf:SGA-3563Z
IC11 = gil_act:LP2981AIM5-3.3
J1 J2 = con-coax_gil:SMA-BORDMIN
JP1 = pinhead:PINHD-1X2: PIN HEADER
L1 L2 L5 L6 L9 L10 L12 L14-L20 = g_passif:L_0603
L3 L4 L7 L8 L11 L13 = g_passif:L_0402
L21COILCRAFT_LPS6225-103 L22COILCRAFT_LPS6225-103 L23COILCRAFT_LPS6225-103 = g_passif:LPS6225
Q1 Q4 = gilloux_rf:Q_20MHZ_SMD
Q3 = gilloux_rf:Q_32K_SMD
R1-R64 = rcl:R-US_: RESISTOR, American symbol
S1 = switch-omron:31-XX: OMRON SWITCH; MPN: B3F-3100; OC_FARNELL: 959704; OC_NEWARK: 36M3582
SAW1-SAW3 = gilloux_rf:SAW_DBLPORT
T1 = gilloux_rf:ETK4-2T
TR1 TR2 = gilloux_rf:TC4-1WG2+
U1 = stm32:STM32F103RCT6: ARM-based 32-bit MCU; MPN: STM32F103RCT6; OC_FARNELL: 1624136; OC_NEWARK: 01P4099; PACKAGE: QFP-64; SUPPLIER: STMICROELECTRONICS
U2 = ad9958:AD9958BCPZ: 2-Channel, 500 MSPS DDS with 10-Bit DACs; MPN: AD9958BCPZ; OC_FARNELL: 1117878; OC_NEWARK: 59K7560; PACKAGE: QFN-56; SUPPLIER: ANALOG DEVICES
U3 U4 U6 U7 U9 = tlv2371:TLV2371IDBVT: OPERATIONAL AMPLIFIERS WITH SHUTDOWN; MPN: TLV2371IDBVT; OC_FARNELL: 8454990; OC_NEWARK: 76C7970; PACKAGE: SOT-23-5; SUPPLIER: Texas Instruments
U5 = ad8362:AD8362ARUZ: Detector; MPN: AD8362ARUZ; OC_FARNELL: 1346351; OC_NEWARK: 19M8903; PACKAGE: TSSOP-16; SUPPLIER: Analog Devices
U8 = ad8302aruz:AD8302ARUZ: LF-2.7 GHz RF/IF Gain and Phase Detector; MPN: AD8302ARUZ; OC_FARNELL: 1305813; OC_NEWARK: 59K6548; PACKAGE: TSSOP-14; SUPPLIER: Analog Devices
U10-U12 = adp2301:ADP2301AUJZ: Step-Down Regulator; MPN: ADP2301AUJZ; OC_FARNELL: 1900088; OC_NEWARK: 55T1460; PACKAGE: TSOT-6; SUPPLIER: ANALOG DEVICES
X1 X2 = usb_con-update:MINI-USB-SHIELD-: MINI USB Connector Source: http://www.hirose.co.jp/cataloge_hp/e24000019.pdf
X3 = con-conrad:73398?: FEMALE PRINT CONNECTOR Niedervolt-Steckverbinder Distributor Conrad